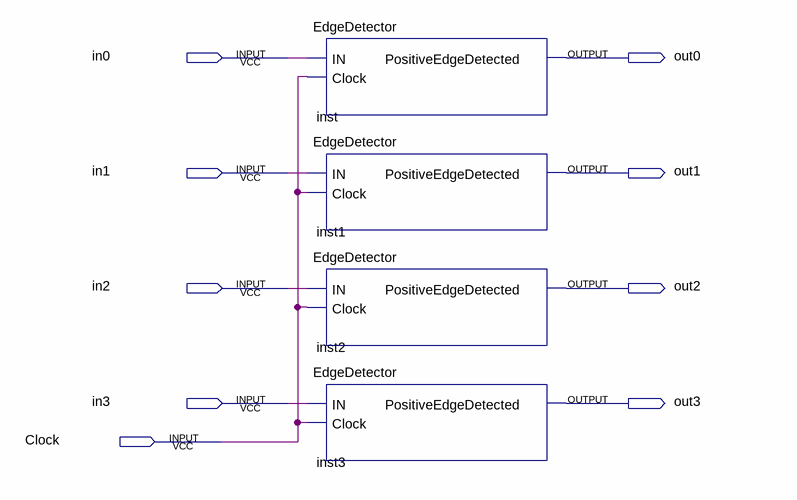
[diagram p0: schematic sheet]
// Quartus schematic QuadEdgeTrigger.bdf as structural Verilog: 4 symbols, 9 pins
module QuadEdgeTrigger (
  input  in0,
  input  in1,
  input  in2,
  input  in3,
  input  Clock,
  output out0,
  output out1,
  output out2,
  output out3
);

  EdgeDetector inst (.IN(in0), .Clock(Clock), .PositiveEdgeDetected(out0));
  EdgeDetector inst1 (.IN(in1), .Clock(Clock), .PositiveEdgeDetected(out1));
  EdgeDetector inst2 (.IN(in2), .Clock(Clock), .PositiveEdgeDetected(out2));
  EdgeDetector inst3 (.IN(in3), .Clock(Clock), .PositiveEdgeDetected(out3));
endmodule
